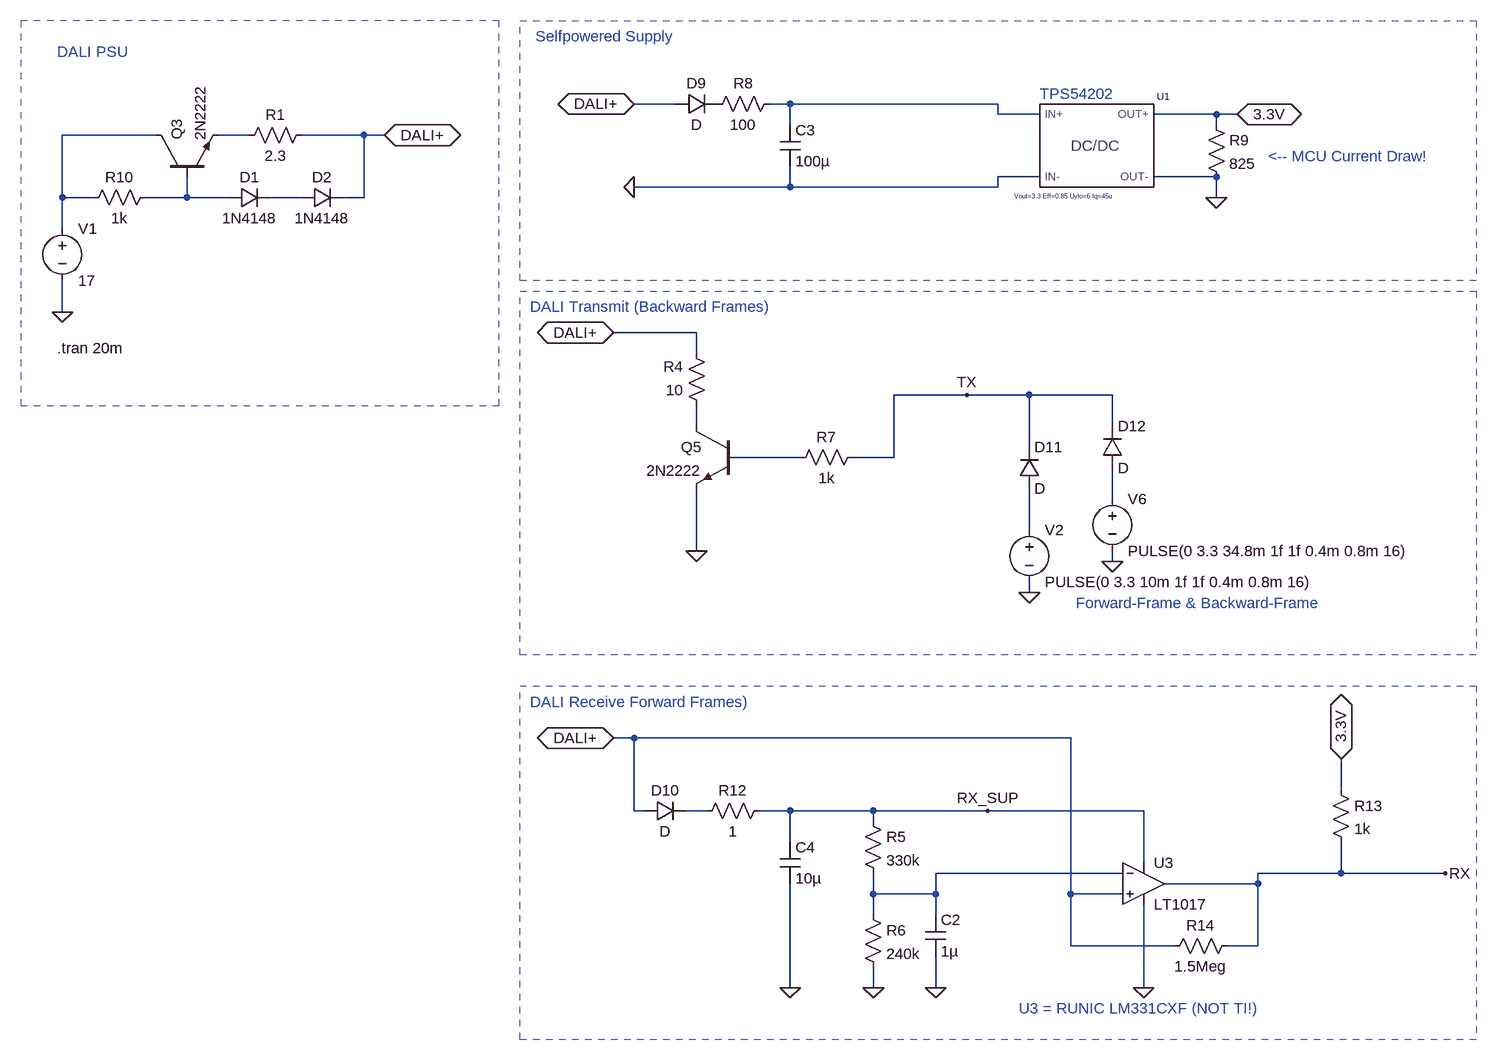
[diagram p0: schematic Phy_Non-Isolated.asc]
Phy_Non-Isolated.asc, the LTspice schematic file:
Version 4
SHEET 1 22984 1472
WIRE 1152 -464 1088 -464
WIRE 1328 -464 1296 -464
WIRE 1648 -464 1328 -464
WIRE 1648 -448 1648 -464
WIRE 1712 -448 1648 -448
WIRE 1984 -448 1888 -448
WIRE 2016 -448 1984 -448
WIRE 1328 -432 1328 -464
WIRE 1984 -432 1984 -448
WIRE 352 -416 208 -416
WIRE 496 -416 448 -416
WIRE 672 -416 576 -416
WIRE 704 -416 672 -416
WIRE 1712 -352 1648 -352
WIRE 1984 -352 1888 -352
WIRE 1328 -336 1328 -368
WIRE 1328 -336 1088 -336
WIRE 1648 -336 1648 -352
WIRE 1648 -336 1328 -336
WIRE 208 -320 208 -416
WIRE 256 -320 208 -320
WIRE 400 -320 400 -352
WIRE 400 -320 336 -320
WIRE 464 -320 400 -320
WIRE 576 -320 528 -320
WIRE 672 -320 672 -416
WIRE 672 -320 640 -320
WIRE 1984 -320 1984 -352
WIRE 208 -272 208 -320
WIRE 208 -144 208 -192
WIRE 1184 -112 1056 -112
WIRE 1184 -80 1184 -112
WIRE 1600 -16 1488 -16
WIRE 1696 -16 1600 -16
WIRE 1824 -16 1696 -16
WIRE 1184 32 1184 0
WIRE 1824 32 1824 -16
WIRE 1696 64 1696 -16
WIRE 1344 80 1248 80
WIRE 1488 80 1488 -16
WIRE 1488 80 1424 80
WIRE 1824 144 1824 96
WIRE 1696 192 1696 128
WIRE 1184 224 1184 128
WIRE 1824 240 1824 224
WIRE 1696 288 1696 272
WIRE 1088 512 1056 512
WIRE 1760 512 1088 512
WIRE 2176 592 2176 544
WIRE 1088 624 1088 512
WIRE 1104 624 1088 624
WIRE 1200 624 1168 624
WIRE 1328 624 1280 624
WIRE 1456 624 1328 624
WIRE 1632 624 1456 624
WIRE 1872 624 1632 624
WIRE 1456 640 1456 624
WIRE 1328 672 1328 624
WIRE 1872 704 1872 624
WIRE 1840 720 1552 720
WIRE 2176 720 2176 672
WIRE 2176 720 2048 720
WIRE 2336 720 2176 720
WIRE 2048 736 2048 720
WIRE 2048 736 1904 736
WIRE 1456 752 1456 720
WIRE 1552 752 1552 720
WIRE 1552 752 1456 752
WIRE 1760 752 1760 512
WIRE 1840 752 1760 752
WIRE 1456 784 1456 752
WIRE 1552 784 1552 752
WIRE 1760 832 1760 752
WIRE 1920 832 1760 832
WIRE 2048 832 2048 736
WIRE 2048 832 2000 832
WIRE 1328 896 1328 736
WIRE 1456 896 1456 864
WIRE 1552 896 1552 848
WIRE 1872 896 1872 768
FLAG 1696 288 0
FLAG 1600 -16 TX
FLAG 1088 -464 DALI+
IOPIN 1088 -464 BiDir
FLAG 1056 512 DALI+
IOPIN 1056 512 BiDir
FLAG 2336 720 RX
FLAG 1632 624 RX_SUP
FLAG 1824 240 0
FLAG 1056 -112 DALI+
IOPIN 1056 -112 BiDir
FLAG 208 -144 0
FLAG 1984 -320 0
FLAG 2016 -448 3.3V
IOPIN 2016 -448 BiDir
FLAG 2176 544 3.3V
IOPIN 2176 544 BiDir
FLAG 704 -416 DALI+
IOPIN 704 -416 BiDir
FLAG 1872 896 0
FLAG 1552 896 0
FLAG 1456 896 0
FLAG 1328 896 0
FLAG 1184 224 0
FLAG 1088 -336 0
SYMBOL voltage 208 -288 R0
WINDOW 123 0 0 Left 0
WINDOW 39 0 0 Left 0
SYMATTR InstName V1
SYMATTR Value 17
SYMBOL voltage 1696 176 R0
WINDOW 123 0 0 Left 0
WINDOW 39 0 0 Left 0
SYMATTR InstName V2
SYMATTR Value PULSE(0 3.3 10m 1f 1f 0.4m 0.8m 16)
SYMBOL res 1440 64 R90
WINDOW 0 0 56 VBottom 2
WINDOW 3 32 56 VTop 2
SYMATTR InstName R7
SYMATTR Value 1k
SYMBOL diode 1152 -480 M90
WINDOW 0 0 32 VBottom 2
WINDOW 3 32 32 VTop 2
SYMATTR InstName D9
SYMBOL cap 1312 -432 R0
SYMATTR InstName C3
SYMATTR Value 100µ
SYMBOL res 480 -400 R270
WINDOW 0 32 56 VTop 2
WINDOW 3 0 56 VBottom 2
SYMATTR InstName R1
SYMATTR Value 2.3
SYMBOL npn 352 -352 R270
SYMATTR InstName Q3
SYMATTR Value 2N2222
SYMBOL res 352 -336 R90
WINDOW 0 0 56 VBottom 2
WINDOW 3 32 56 VTop 2
SYMATTR InstName R10
SYMATTR Value 1k
SYMBOL diode 464 -304 R270
WINDOW 0 32 32 VTop 2
WINDOW 3 0 32 VBottom 2
SYMATTR InstName D1
SYMATTR Value 1N4148
SYMBOL diode 576 -304 R270
WINDOW 0 32 32 VTop 2
WINDOW 3 0 32 VBottom 2
SYMATTR InstName D2
SYMATTR Value 1N4148
SYMBOL res 2160 576 R0
SYMATTR InstName R13
SYMATTR Value 1k
SYMBOL cap 1312 672 R0
SYMATTR InstName C4
SYMATTR Value 10µ
SYMBOL Comparators\\LT1017 1872 736 R0
SYMATTR InstName U3
SYMBOL voltage 1824 128 R0
WINDOW 123 0 0 Left 0
WINDOW 39 0 0 Left 0
SYMATTR InstName V6
SYMATTR Value PULSE(0 3.3 34.8m 1f 1f 0.4m 0.8m 16)
SYMBOL diode 1680 128 M180
WINDOW 0 24 64 Left 2
WINDOW 3 24 0 Left 2
SYMATTR InstName D11
SYMBOL diode 1808 96 M180
WINDOW 0 24 64 Left 2
WINDOW 3 24 0 Left 2
SYMATTR InstName D12
SYMBOL diode 1104 640 R270
WINDOW 0 32 32 VTop 2
WINDOW 3 0 32 VBottom 2
SYMATTR InstName D10
SYMBOL res 1296 608 R90
WINDOW 0 0 56 VBottom 2
WINDOW 3 32 56 VTop 2
SYMATTR InstName R12
SYMATTR Value 1
SYMBOL npn 1248 32 M0
SYMATTR InstName Q5
SYMATTR Value 2N2222
SYMBOL res 1200 16 R180
WINDOW 0 36 76 Left 2
WINDOW 3 36 40 Left 2
SYMATTR InstName R4
SYMATTR Value 10
SYMBOL res 1440 624 R0
SYMATTR InstName R5
SYMATTR Value 330k
SYMBOL res 1440 768 R0
SYMATTR InstName R6
SYMATTR Value 240k
SYMBOL cap 1536 784 R0
SYMATTR InstName C2
SYMATTR Value 1µ
SYMBOL IDEAL_DCDC 1744 -400 R0
SYMATTR SpiceLine Vout=3.3 Eff=0.85 Uvlo=6 Iq=45u
SYMATTR InstName U1
SYMBOL res 1312 -480 R90
WINDOW 0 0 56 VBottom 2
WINDOW 3 32 56 VTop 2
SYMATTR InstName R8
SYMATTR Value 100
SYMBOL res 1968 -448 R0
SYMATTR InstName R9
SYMATTR Value 825
SYMBOL res 2016 816 R90
WINDOW 0 0 56 VBottom 2
WINDOW 3 32 56 VTop 2
SYMATTR InstName R14
SYMATTR Value 1.5Meg
TEXT 200 -88 Left 2 !.tran 20m
TEXT 1712 -480 Left 2 ;TPS54202
TEXT 1680 928 Left 2 ;U3 = RUNIC LM331CXF (NOT TI!)
TEXT 2064 -384 Left 2 ;<-- MCU Current Draw!
TEXT 1768 304 Left 2 ;Forward-Frame & Backward-Frame
TEXT 200 -544 Left 2 ;DALI PSU
TEXT 936 -568 Left 2 ;Selfpowered Supply
TEXT 928 -152 Left 2 ;DALI Transmit (Backward Frames)
TEXT 928 456 Left 2 ;DALI Receive Forward Frames)
RECTANGLE Normal 2384 -192 912 -592 2
RECTANGLE Normal 2384 384 912 -176 2
RECTANGLE Normal 2384 976 912 432 2
RECTANGLE Normal 144 0 880 -592 2

The netlist it stands for:
* Phy_Non-Isolated.asc
V1 N002 0 17
V2 N009 0 PULSE(0 3.3 10m 1f 1f 0.4m 0.8m 16)
R7 TX N007 1k
D9 DALI+ P001 D
C3 N001 0 100µ
R1 N003 DALI+ 2.3
Q3 N002 N004 N003 0 2N2222
R10 N004 N002 1k
D1 N004 N005 1N4148
D2 N005 DALI+ 1N4148
R13 3.3V RX 1k
C4 RX_SUP 0 10µ
XU3 DALI+ N011 RX_SUP 0 RX LT1017  ; pins In+ In- V+ V- OUT
V6 N008 0 PULSE(0 3.3 34.8m 1f 1f 0.4m 0.8m 16)
D11 N009 TX D
D12 N008 TX D
D10 DALI+ N010 D
R12 RX_SUP N010 1
Q5 N006 N007 0 0 2N2222
R4 N006 DALI+ 10
R5 RX_SUP N011 330k
R6 N011 0 240k
C2 N011 0 1µ
XU1 N001 0 3.3V 0 IDEAL_DCDC IDEAL_DCDC Vout=3.3 Eff=0.85 Uvlo=6 Iq=45u  ; pins IN+ IN- OUT+ OUT-
R8 N001 P001 100
R9 3.3V 0 825
R14 RX DALI+ 1.5Meg
.model D D
.lib standard.dio
.model NPN NPN
.model PNP PNP
.lib standard.bjt
.tran 20m
* TPS54202
* U3 = RUNIC LM331CXF (NOT TI!)
* <-- MCU Current Draw!
* Forward-Frame & Backward-Frame
* DALI PSU
* Selfpowered Supply
* DALI Transmit (Backward Frames)
* DALI Receive Forward Frames)
.lib IDEAL_DCDC.lib
.backanno
.end